# Altium schematic sheet ESP32S3.SchDoc
size A3; SheetNumber: 2; SheetTotal: 7
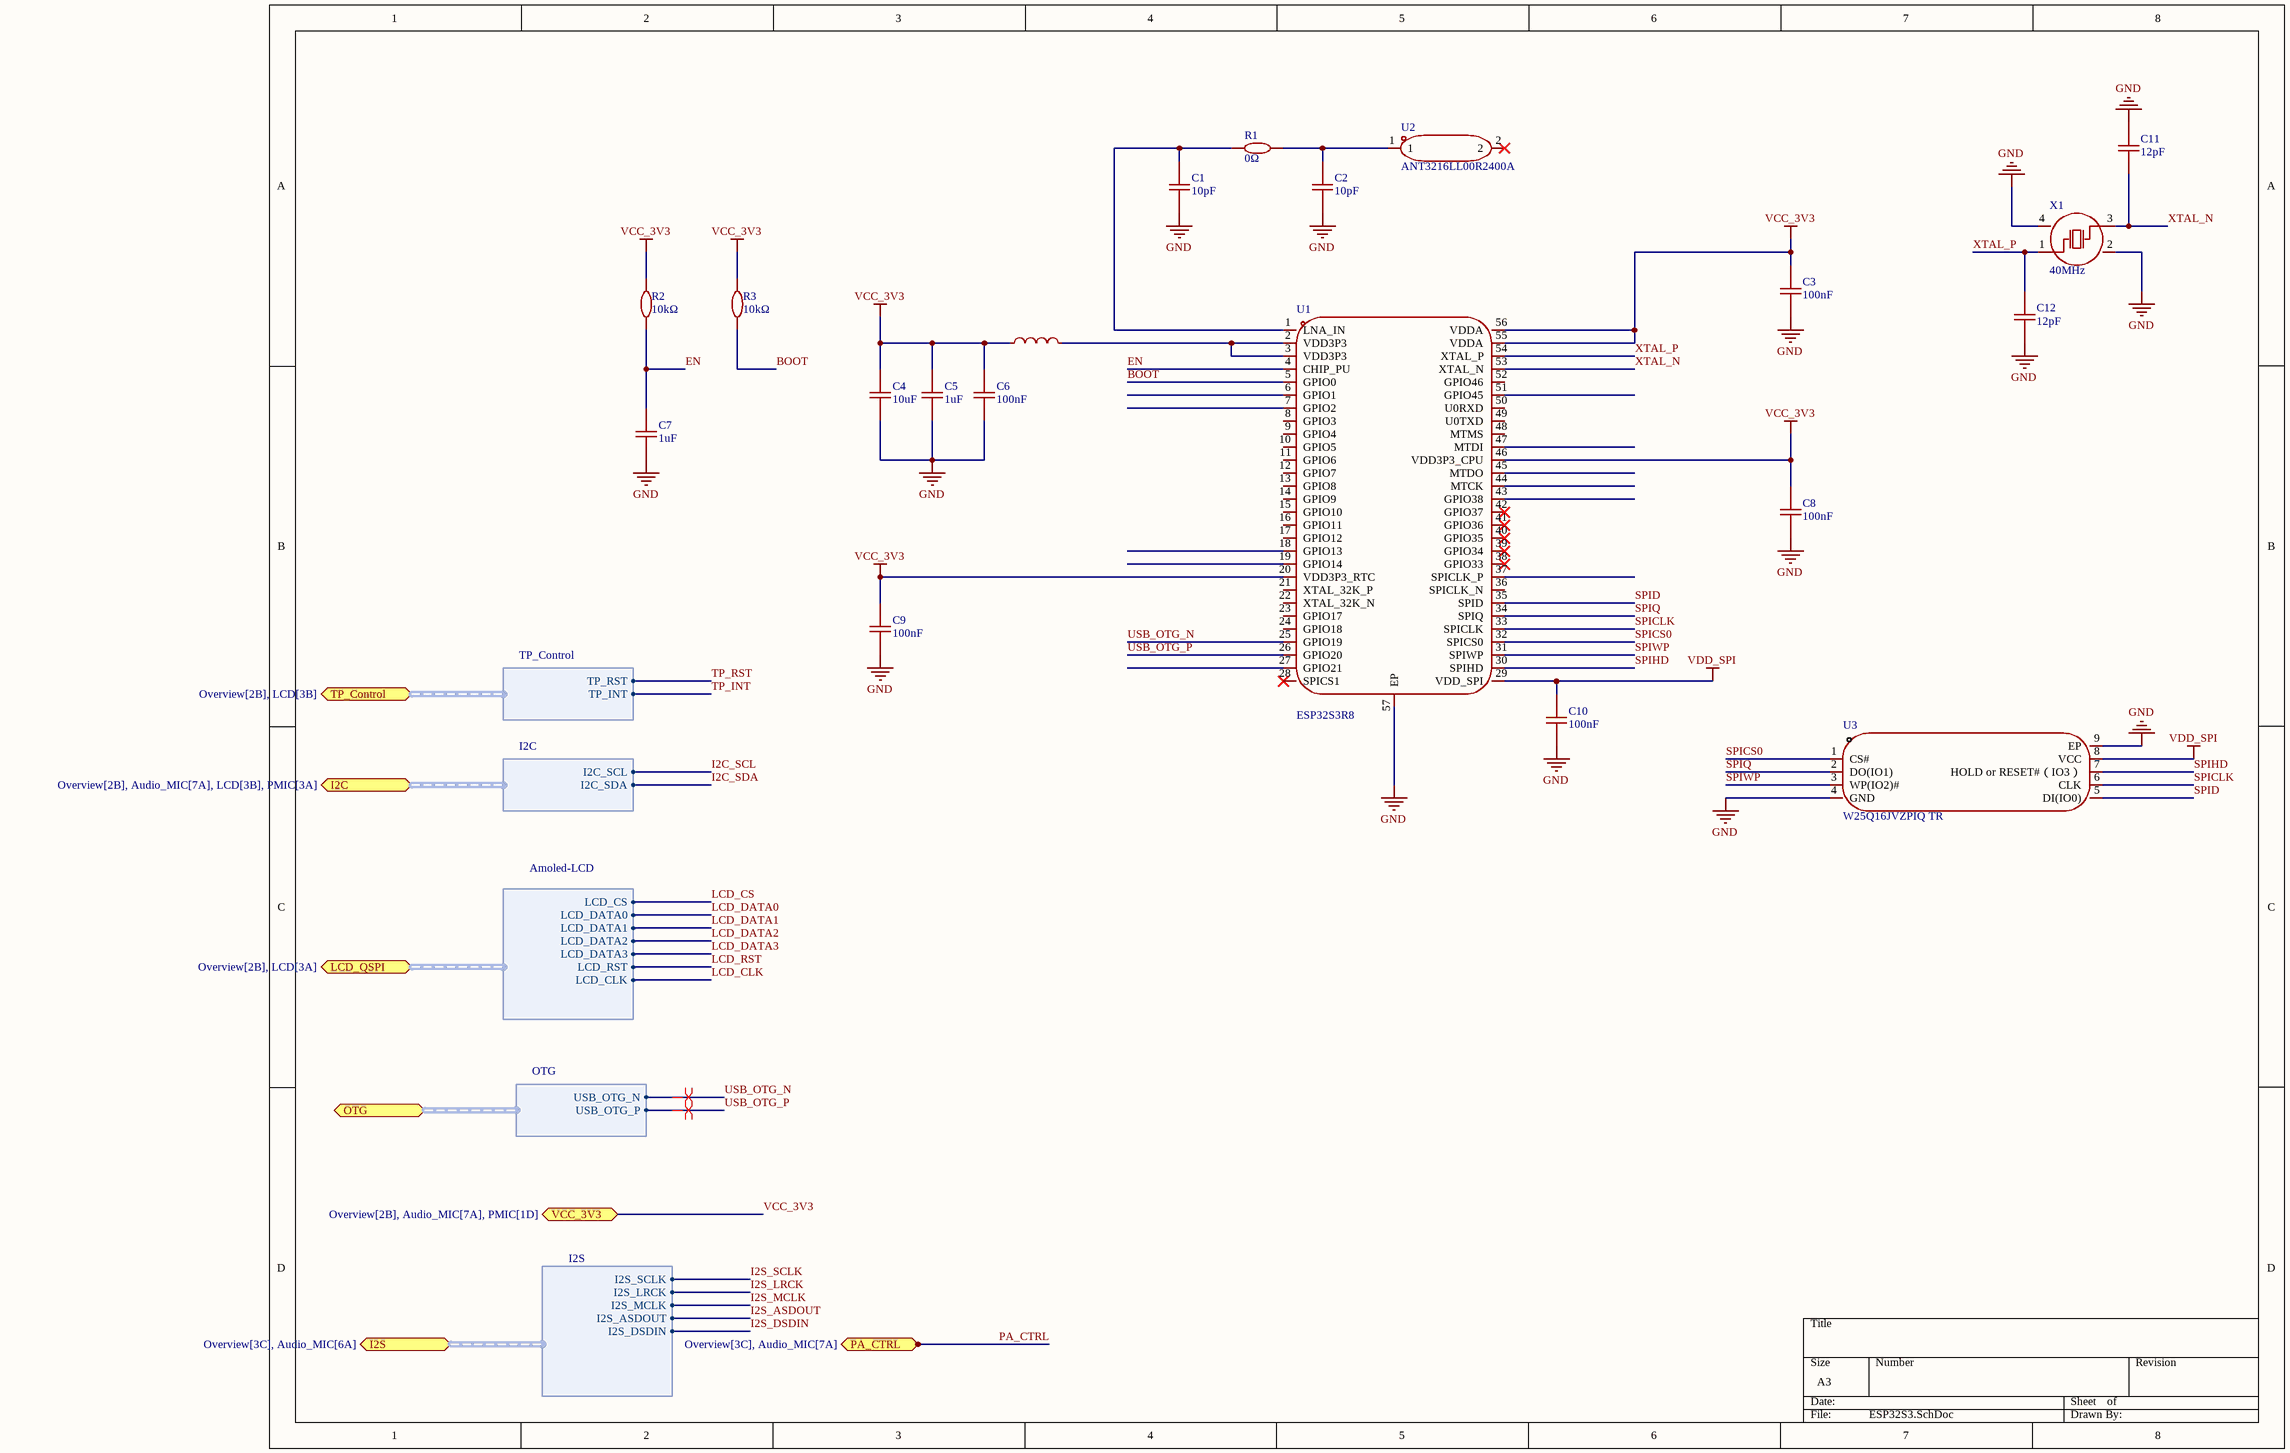
[diagram p0: ESP32S3.SchDoc]

## Parts
C1  10pF  [C0402]
C2  10pF  [C0402]
C3  100nF  [C0402]
C4  10uF  [C0603]
C5  1uF  [C0402]
C6  100nF  [C0402]
C7  1uF  [C0402]
C8  100nF  [C0402]
C9  100nF  [C0402]
C10  100nF  [C0402]
C11  12pF  [C0402]
C12  12pF  [C0402]
L1  2nH  [L0402]  (value not drawn)
R1  0Ω  [R0402]
R2  10kΩ  [R0402]
R3  10kΩ  [R0402]
U1  ESP32S3R8  [QFN-56_L7.0-W7.0-P0.40-TL-EP4.0]
U2  ANT3216LL00R2400A  [ANT-SMD_L3.2-W1.6]
U3  W25Q16JVZPIQ TR  [WSON-8_L6.0-W5.0-P1.27-BL-EP]
X1  40MHz  [OSC-SMD_4P-L3.2-W2.5-BL_SIT8008BI]

## Ports
I2C (bidir, harness I2C, see Overview[2B], Audio_MIC[7A], LCD[3B], PMIC[3A]), I2S (bidir, harness I2S, see Overview[3C], Audio_MIC[6A]), LCD_QSPI (bidir, harness Amoled-LCD, see Overview[2B], LCD[3A]), OTG (bidir, harness OTG), PA_CTRL (bidir, see Overview[3C], Audio_MIC[7A]), TP_Control (bidir, harness TP_Control, see Overview[2B], LCD[3B]), VCC_3V3 (bidir, see Overview[2B], Audio_MIC[7A], PMIC[1D])

## Harnesses
Amoled-LCD: LCD_CS, LCD_DATA0, LCD_DATA1, LCD_DATA2, LCD_DATA3, LCD_RST, LCD_CLK
I2C: I2C_SCL, I2C_SDA
TP_Control: TP_RST, TP_INT
OTG: USB_OTG_N, USB_OTG_P
I2S: I2S_SCLK, I2S_LRCK, I2S_MCLK, I2S_ASDOUT, I2S_DSDIN

## Nets
GND: C1.1 C2.1 C3.1 C4.1 C5.1 C6.1 C7.1 C8.1 C9.1 C10.1 C11.2 C12.1 U1.57(EP) U3.4(GND) U3.9(EP) X1.2(GND) X1.4(GND)
VCC_3V3: C3.2 C4.2 C5.2 C6.2 C8.2 C9.2 L1.1 R2.2 R3.2 U1.20(VDD3P3_RTC) U1.46(VDD3P3_CPU) U1.55(VDDA) U1.56(VDDA) ; port VCC_3V3
VDD_SPI: C10.2 U1.29(VDD_SPI) U3.8(VCC)
BOOT: R3.1 U1.5(GPIO0)
EN: C7.2 R2.1 U1.4(CHIP_PU)
I2C_SCL: port I2C.I2C_SCL
I2C_SDA: port I2C.I2C_SDA
I2S_ASDOUT: port I2S.I2S_ASDOUT
I2S_DSDIN: port I2S.I2S_DSDIN
I2S_LRCK: port I2S.I2S_LRCK
I2S_MCLK: port I2S.I2S_MCLK
I2S_SCLK: port I2S.I2S_SCLK
LCD_CLK: port LCD_QSPI.LCD_CLK
LCD_CS: port LCD_QSPI.LCD_CS
LCD_DATA0: port LCD_QSPI.LCD_DATA0
LCD_DATA1: port LCD_QSPI.LCD_DATA1
LCD_DATA2: port LCD_QSPI.LCD_DATA2
LCD_DATA3: port LCD_QSPI.LCD_DATA3
LCD_RST: port LCD_QSPI.LCD_RST
PA_CTRL: port PA_CTRL
SPICLK: U1.33(SPICLK) U3.6(CLK)
SPICS0: U1.32(SPICS0) U3.1(CS#)
SPID: U1.35(SPID) U3.5(DI(IO0))
SPIHD: U1.30(SPIHD) U3.7(HOLD_or_RESET#（IO3）)
SPIQ: U1.34(SPIQ) U3.2(DO(IO1))
SPIWP: U1.31(SPIWP) U3.3(WP(IO2)#)
TP_INT: port TP_Control.TP_INT
TP_RST: port TP_Control.TP_RST
USB_OTG_N: U1.25(GPIO19) ; port OTG.USB_OTG_N
USB_OTG_P: U1.26(GPIO20) ; port OTG.USB_OTG_P
XTAL_N: C11.1 U1.53(XTAL_N) X1.3(OSC2)
XTAL_P: C12.2 U1.54(XTAL_P) X1.1(OSC1)
NetC1_2: C1.2 R1.1 U1.1(LNA_IN)
NetC2_2: C2.2 R1.2 U2.1
NetL1_2: L1.2 U1.2(VDD3P3) U1.3(VDD3P3)

Not connected (* = marked no-connect by the designer): U1 6(GPIO1) 7(GPIO2) 8(GPIO3) 9(GPIO4) 10(GPIO5) 11(GPIO6) 12(GPIO7) 13(GPIO8) 14(GPIO9) 15(GPIO10) 16(GPIO11) 17(GPIO12) 18(GPIO13) 19(GPIO14) 21(XTAL_32K_P) 22(XTAL_32K_N) 23(GPIO17) 24(GPIO18) 27(GPIO21) 28(SPICS1)* 36(SPICLK_N) 37(SPICLK_P) 38(GPIO33)* 39(GPIO34)* 40(GPIO35)* 41(GPIO36)* 42(GPIO37)* 43(GPIO38) 44(MTCK) 45(MTDO) 47(MTDI) 48(MTMS) 49(U0TXD) 50(U0RXD) 51(GPIO45) 52(GPIO46); U2 2*

## Layout directives
differential pair: USB_OTG_N, USB_OTG_P

## Library data of the parts
C1 C2 = 10pF: 50V 10pF C0G ±5% 0402 Ceramic Capacitors ROHS
C3 C6 C8-C10 = 100nF: 50V 100nF X7R ±10% 0402 Ceramic Capacitors ROHS
C4 = 10uF: 10V 10uF X5R ±10% 0603 Ceramic Capacitors ROHS
C5 C7 = 1uF: 50V 1uF X5R ±10% 0402 Ceramic Capacitors ROHS
C11 C12 = 12pF: 50V 12pF C0G ±5% 0402 Ceramic Capacitors ROHS
L1 = MLG1005S2N0BT000: L0402 2nH ±0.1nH; Manufacturer: Sunltech(顺磁); Symbol: SLW4030S1R0NST; Add into BOM: yes; Value: 1uH; Tolerance: ±30%; Current Rating: 4.15A; DC Resistance(DCR): 18mΩ; Device: SLW4030S1R0NST; LCSC Part Name: 1uH ±30%; Supplier Part: C206354; Manufacturer Part: SLW4030S1R0NST; Supplier Footprint: SMD,4x4mm; JLCPCB Part Class: Extended Part; Datasheet: https://item.szlcsc.com/datasheet/SLW4030S1R0NST/207399.html; Supplier: LCSC; Convert to PCB: yes
R1 = 0Ω: 0Ω 62.5mW 50V Thick Film Resistor ±1% 0402 Chip Resistor - Surface Mount ROHS
R2 R3 = 10kΩ: 62.5mW 10kΩ 50V ±100ppm/℃ Thick Film Resistor ±1% 0402 Chip Resistor - Surface Mount ROHS
U1 = ESP32S3R8: 2.4GHz Wi-Fi + 低功耗蓝牙系统级芯片（SoC）
U3 = W25Q16JVZPIQ TR: WSON-8-EP(5x6) W25Q128JV（128M位）串行闪存为空间、引脚和电源受限的系统提供了存储解决方案。25Q系列具备灵活性和高性能。
X1 = X322540MPB4SI: Crystal Oscillator 15pF SMD3225-4P Crystals ROHS